# EAGLE design OptoSense (EAGLE 9.3.2)

## Sheet 1 of 3
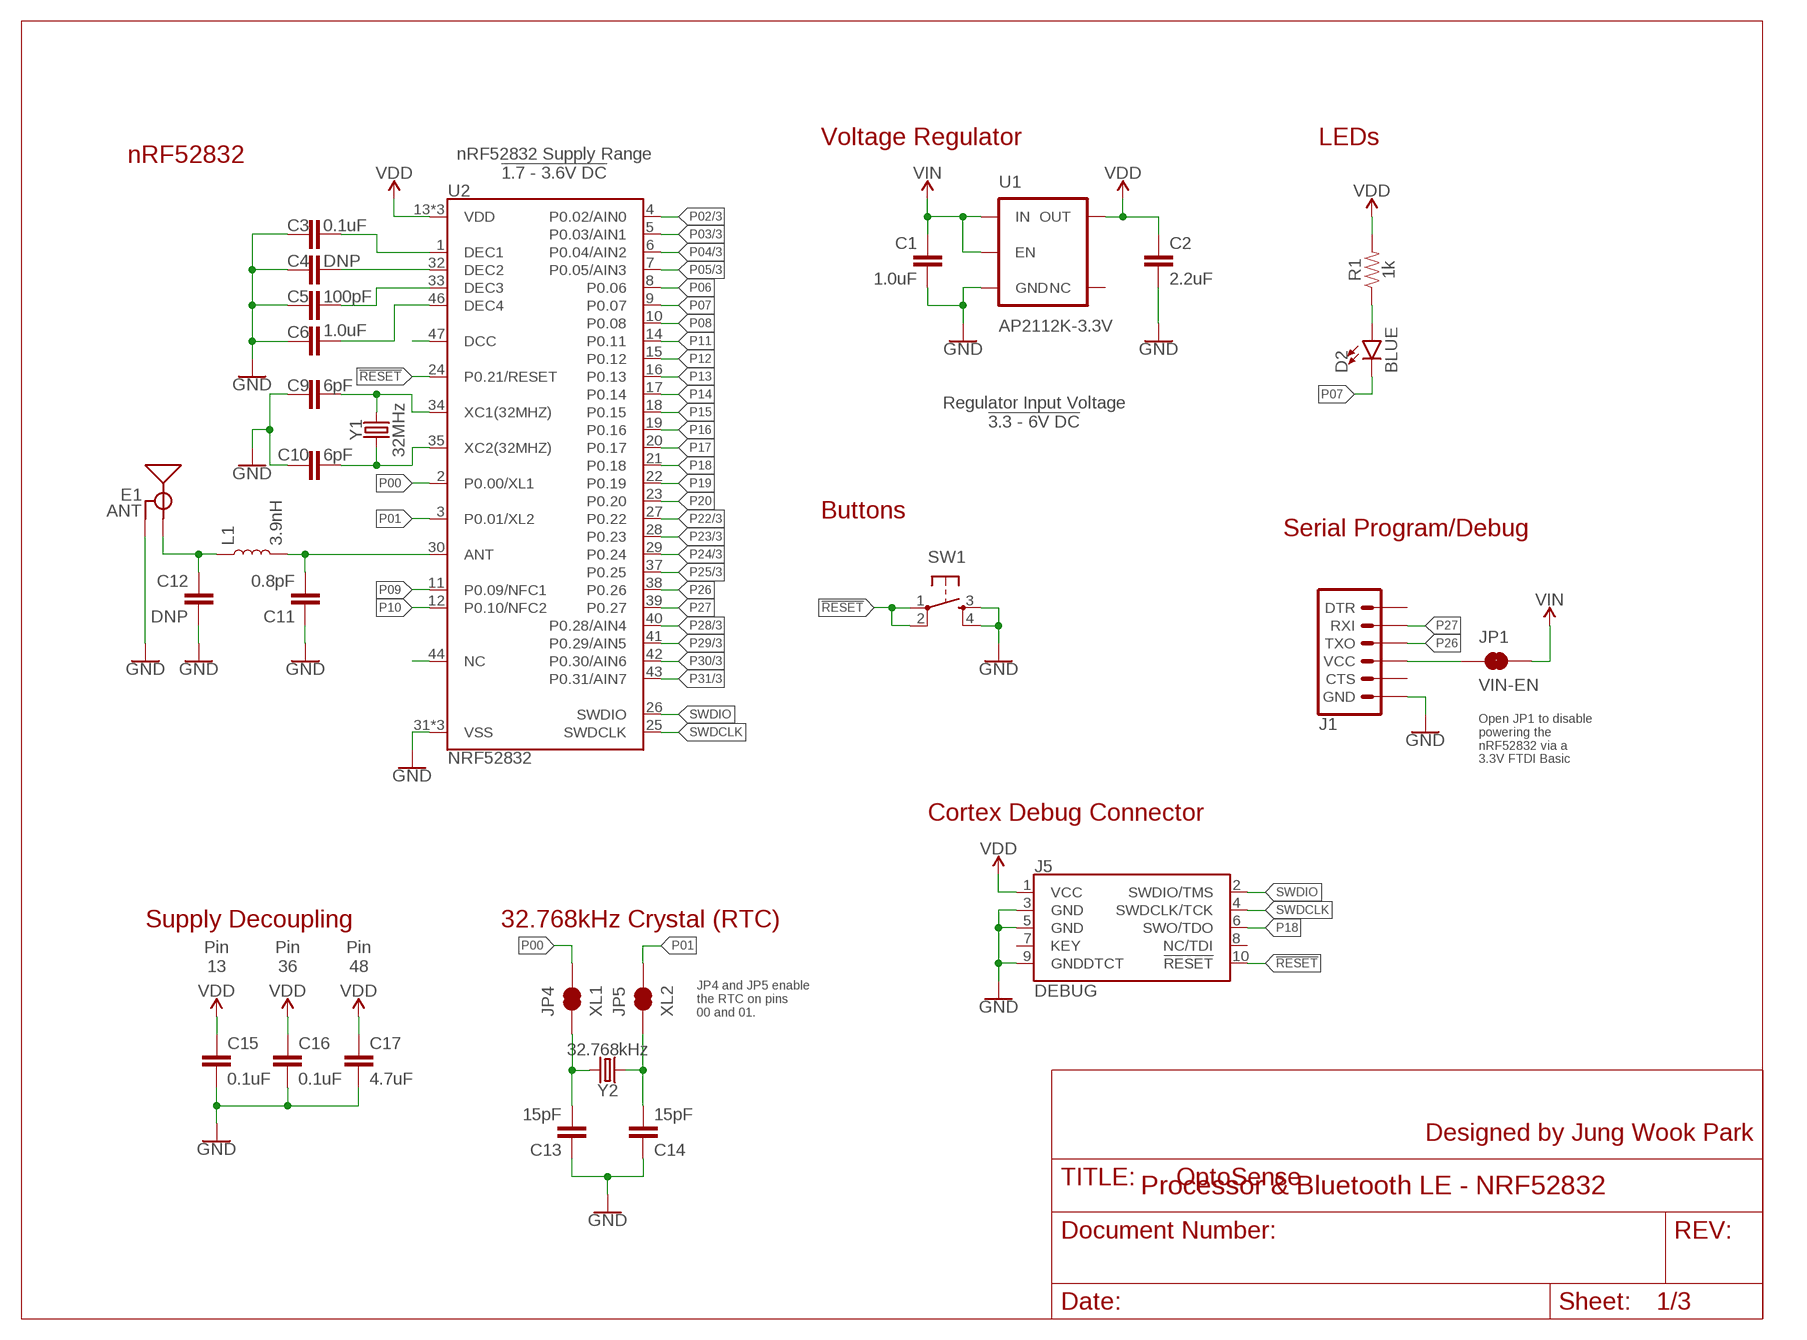
[diagram p0: schematic, sheet 1]

### Parts
C1  1.0uF  1.0UF-0603-16V-10%  [0603]
C2  2.2uF  2.2UF-0603-10V-20%  [0603]
C3  0.1uF  0.1UF-0402-16V-10%  [0402]
C4  DNP  CAP0402  [0402]
C5  100pF  100PF-0402-50V-5%  [0402]
C6  1.0uF  1.0UF-0402-16V-10%  [0402]
C9  6pF  6PF-0402-50V-0.5%  [0402]
C10  6pF  6PF-0402-50V-0.5%  [0402]
C11  0.8pF  0.8PF-0402-50V-0.1PF  [0402]
C12  DNP  CAP0402  [0402]
C13  15pF  15PF-0402-50V-5%  [0402]
C14  15pF  15PF-0402-50V-5%  [0402]
C15  0.1uF  0.1UF-0402-16V-10%  [0402]
C16  0.1uF  0.1UF-0402-16V-10%  [0402]
C17  4.7uF  4.7UF0603  [0603]
D2  BLUE  LED-BLUE0603  [LED-0603]
E1  ANT  ANTENNA-GROUNDEDTRACE-15.2MM  [TRACE_ANTENNA_2.4GHZ_15.2MM]
J1  ARDUINO_SERIAL_PROGRAMPTH  [1X06]
J5  DEBUG  CORTEX_DEBUGPTH  [2X5-PTH-1.27MM]
JP1  VIN-EN  JUMPER-SMT_2_NC_TRACE_SILK  [SMT-JUMPER_2_NC_TRACE_SILK]
JP4  XL1  JUMPER-PAD-2-NC_BY_TRACE  [PAD-JUMPER-2-NC_BY_TRACE_YES_SILK]
JP5  XL2  JUMPER-PAD-2-NC_BY_TRACE  [PAD-JUMPER-2-NC_BY_TRACE_YES_SILK]
L1  3.9nH  INDUCTOR-0402-3.9NH  [0402]
R1  1k  1KOHM-0603-1/10W-1%  [0603]
SW1  SWITCH_SPST_4_PINRECT  [TACTILE_SWITCH_SMD_4.6X2.8MM]
U1  AP2112K-3.3V  V_REG_AP2112K-3.3V  [SOT23-5]
U2  NRF52832  [QFN48-6X6MM]
Y1  32MHz  CRYSTAL-32MHZ-SMD-2.0X1.6MM  [CRYSTAL-SMD-2.0X1.6MM]
Y2  32.768kHz  CRYSTAL-32.768KHZSMD-3.2X1.5  [CRYSTAL-SMD-3.2X1.5MM]

### Nets
!RESET!: J5.10(!RESET) SW1.1 SW1.2 U2.24(P0.21/RESET)
ANT: C11.2 L1.2 U2.30(ANT)
DCC: U2.47(DCC)
DEC1: C3.2 U2.1(DEC1)
DEC2: C4.2 U2.32(DEC2)
DEC3: C5.2 U2.33(DEC3)
DEC4: C6.2 U2.46(DEC4)
GND: C1.2 C2.2 C3.1 C4.1 C5.1 C6.1 C9.1 C10.2 C11.1 C12.2 C13.1 C14.1 C15.2 C16.2 C17.2 E1.GND J1.6(GND) J5.3(GND) J5.5(GND) J5.9(GNDDTCT) SW1.3 SW1.4 U1.2(GND) U2.31(VSS) U2.45(VSS) U2.EP(VSS) ; also sheet 2,3
N$3: C13.2 JP4.1 Y2.P$2
N$4: C14.2 JP5.1 Y2.P$1
N$11: C12.1 E1.ANT(SIGNAL) L1.1
N$14: J1.4(VCC) JP1.1
N$15: D2.A R1.1
NC: U2.44(NC)
P00: JP4.2 U2.2(P0.00/XL1)
P01: JP5.2 U2.3(P0.01/XL2)
P02: U2.4(P0.02/AIN0) ; also sheet 3
P03: U2.5(P0.03/AIN1) ; also sheet 3
P04: U2.6(P0.04/AIN2) ; also sheet 3
P05: U2.7(P0.05/AIN3) ; also sheet 3
P06: U2.8(P0.06)
P07: D2.C U2.9(P0.07)
P08: U2.10(P0.08)
P09: U2.11(P0.09/NFC1)
P10: U2.12(P0.10/NFC2)
P11: U2.14(P0.11)
P12: U2.15(P0.12)
P13: U2.16(P0.13)
P14: U2.17(P0.14)
P15: U2.18(P0.15)
P16: U2.19(P0.16)
P17: U2.20(P0.17)
P18: J5.6(SWO/TDO) U2.21(P0.18)
P19: U2.22(P0.19)
P20: U2.23(P0.20)
P22: U2.27(P0.22) ; also sheet 3
P23: U2.28(P0.23) ; also sheet 3
P24: U2.29(P0.24) ; also sheet 3
P25: U2.37(P0.25) ; also sheet 3
P26: J1.3(TXO) U2.38(P0.26)
P27: J1.2(RXI) U2.39(P0.27)
P28: U2.40(P0.28/AIN4) ; also sheet 3
P29: U2.41(P0.29/AIN5) ; also sheet 3
P30: U2.42(P0.30/AIN6) ; also sheet 3
P31: U2.43(P0.31/AIN7) ; also sheet 3
SWDCLK: J5.4(SWDCLK/TCK) U2.25(SWDCLK)
SWDIO: J5.2(SWDIO/TMS) U2.26(SWDIO)
VDD: C2.1 C15.1 C16.1 C17.1 J5.1(VCC) R1.2 U1.5(OUT) U2.13(VDD) U2.36(VDD) U2.48(VDD) ; also sheet 3
VIN: C1.1 JP1.2 U1.1(IN) U1.3(EN) ; also sheet 2
XC1: C9.2 U2.34(XC1(32MHZ)) Y1.3
XC2: C10.1 U2.35(XC2(32MHZ)) Y1.1
Unconnected: J1.1(DTR) J1.5(CTS) J5.7(KEY) J5.8(NC/TDI) U1.4(NC)

### Notes on the sheet
- Voltage Regulator | LEDs
- nRF52832
- nRF52832 Supply Range
  !1.7 - 3.6V DC!
- Regulator Input Voltage
  !3.3 - 6V DC!
- Buttons
- Serial Program/Debug
- Open JP1 to disable 
  powering the 
  nRF52832 via a
  3.3V FTDI Basic
- Cortex Debug Connector
- Supply Decoupling | 32.768kHz Crystal (RTC)
- Pin
  13
- Pin
  36
- Pin
  48
- JP4 and JP5 enable
  the RTC on pins
  00 and 01.
- Designed by Jung Wook Park
- Processor & Bluetooth LE - NRF52832

## Sheet 2 of 3
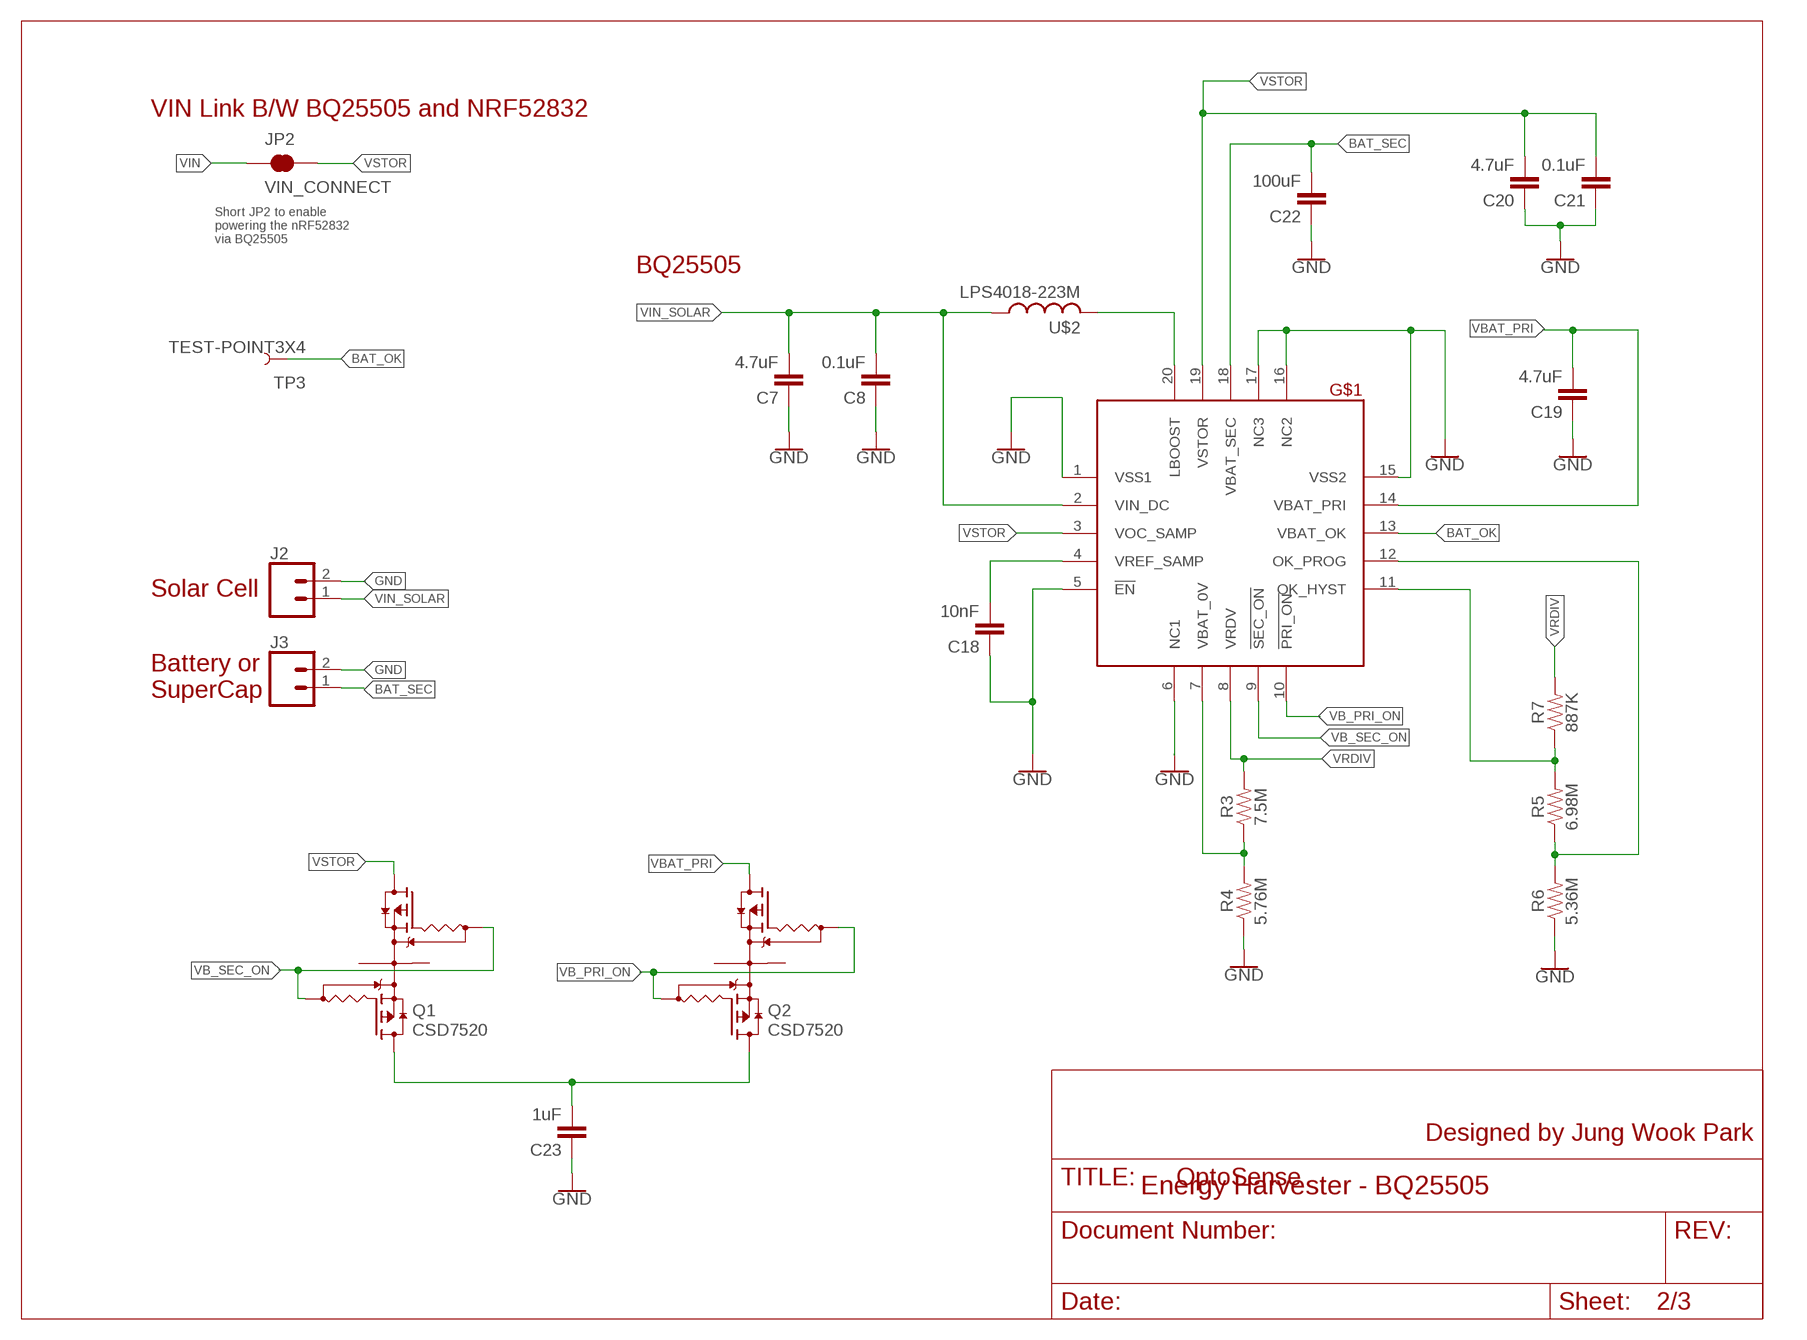
[diagram p1: schematic, sheet 2]

### Parts
C7  4.7uF  0.8PF-0402-50V-0.1PF  [0402]
C8  0.1uF  0.8PF-0402-50V-0.1PF  [0402]
C18  10nF  0.8PF-0402-50V-0.1PF  [0402]
C19  4.7uF  0.8PF-0402-50V-0.1PF  [0402]
C20  4.7uF  0.8PF-0402-50V-0.1PF  [0402]
C21  0.1uF  0.8PF-0402-50V-0.1PF  [0402]
C22  100uF  0.8PF-0402-50V-0.1PF  [0402]
C23  1uF  0.8PF-0402-50V-0.1PF  [0402]
J2  CONN_02  [1X02]
J3  CONN_02  [1X02]
JP2  VIN_CONNECT  JUMPER-SMT_2_NC_TRACE_SILK  [SMT-JUMPER_2_NC_TRACE_SILK]
Q1  CSD7520  CSD75205W1015-BGA  [CSD75205W1015]
Q2  CSD7520  CSD75205W1015-BGA  [CSD75205W1015]
R3  7.5M  1KOHM-0603-1/10W-1%  [0603]
R4  5.76M  1KOHM-0603-1/10W-1%  [0603]
R5  6.98M  1KOHM-0603-1/10W-1%  [0603]
R6  5.36M  1KOHM-0603-1/10W-1%  [0603]
R7  887K  1KOHM-0603-1/10W-1%  [0603]
TP3  TEST-POINT3X4  [PAD.03X.04]
U$1  BQ25505  [QFN20]
U$2  LPS4018-223M  LPS4018  [LPS4018]

### Nets
BAT_OK: TP3.P$1 U$1.13(VBAT_OK)
BAT_SEC: C22.2 J3.1 U$1.18(VBAT_SEC)
GND: C7.1 C8.1 C18.1 C19.1 C20.1 C21.1 C22.1 C23.1 J2.2 J3.2 R4.1 R6.1 U$1.1(VSS1) U$1.5(!EN) U$1.6(NC1) U$1.15(VSS2) U$1.16(NC2) U$1.17(NC3) ; also sheet 1,3
N$2: U$1.20(LBOOST) U$2.P$2
N$5: C18.2 U$1.4(VREF_SAMP)
N$6: R3.1 R4.2 U$1.7(VBAT_0V)
N$7: R5.1 R6.2 U$1.12(OK_PROG)
N$8: R5.2 R7.1 U$1.11(OK_HYST)
N$9: C23.2 Q1.D1 Q2.D1
VB_PRI_ON: Q2.G1 Q2.G2 U$1.10(!PRI_ON)
VB_SEC_ON: Q1.G1 Q1.G2 U$1.9(!SEC_ON)
VBAT_PRI: C19.2 Q2.D2 U$1.14(VBAT_PRI)
VIN: JP2.1 ; also sheet 1
VIN_SOLAR: C7.2 C8.2 J2.1 U$1.2(VIN_DC) U$2.P$1
VRDIV: R3.2 R7.2 U$1.8(VRDV)
VSTOR: C20.2 C21.2 JP2.2 Q1.D2 U$1.3(VOC_SAMP) U$1.19(VSTOR)
Unconnected: Q1.S1 Q1.S2 Q2.S1 Q2.S2

### Notes on the sheet
- VIN Link B/W BQ25505 and NRF52832
- Short JP2 to enable 
  powering the nRF52832 
  via BQ25505
- BQ25505
- Solar Cell
- Battery or
  SuperCap
- Designed by Jung Wook Park
- Energy Harvester - BQ25505

## Sheet 3 of 3
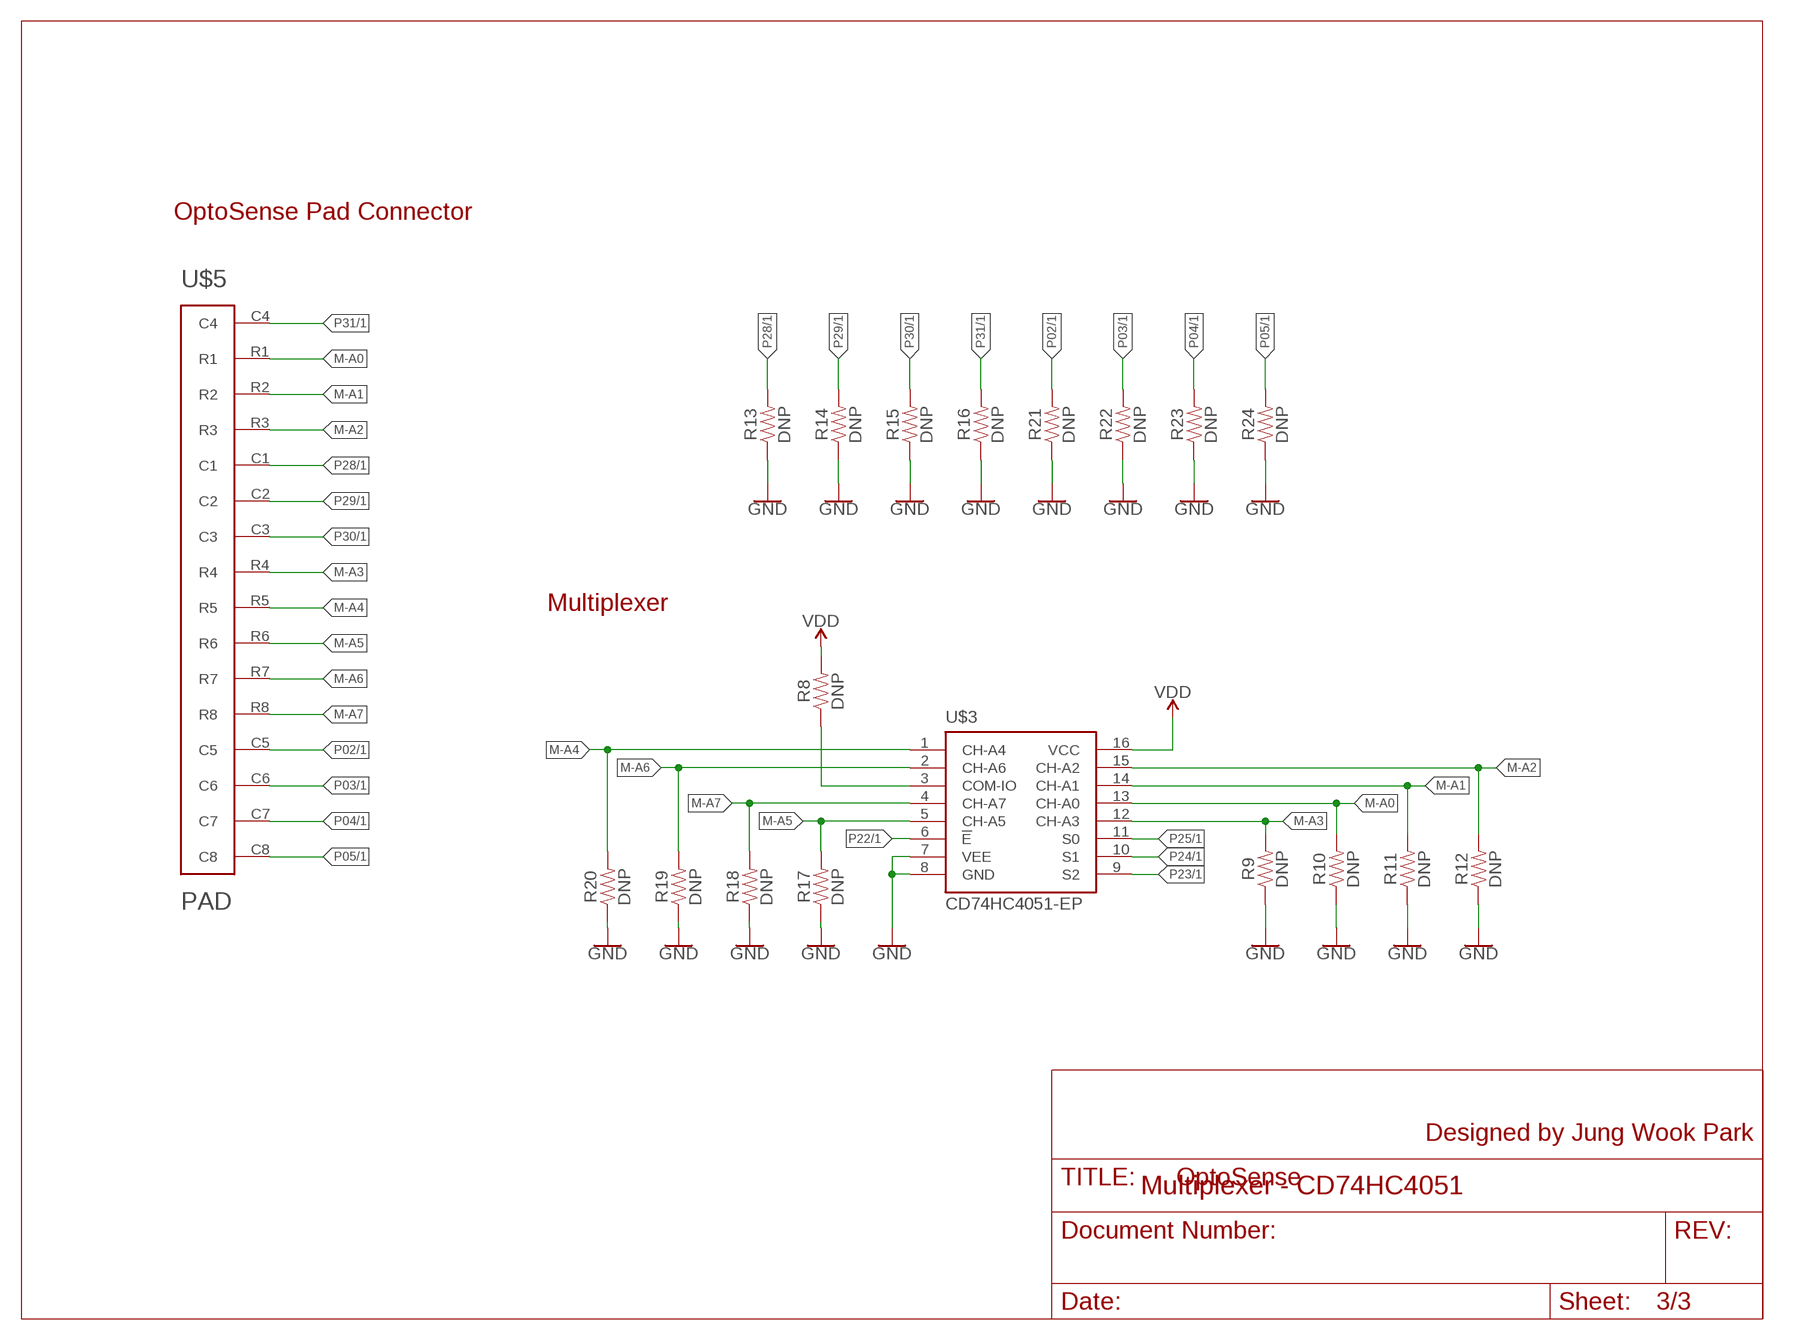
[diagram p2: schematic, sheet 3]

### Parts
R8  DNP  1KOHM-0603-1/10W-1%  [0603]
R9  DNP  1KOHM-0603-1/10W-1%  [0603]
R10  DNP  1KOHM-0603-1/10W-1%  [0603]
R11  DNP  1KOHM-0603-1/10W-1%  [0603]
R12  DNP  1KOHM-0603-1/10W-1%  [0603]
R13  DNP  1KOHM-0603-1/10W-1%  [0603]
R14  DNP  1KOHM-0603-1/10W-1%  [0603]
R15  DNP  1KOHM-0603-1/10W-1%  [0603]
R16  DNP  1KOHM-0603-1/10W-1%  [0603]
R17  DNP  1KOHM-0603-1/10W-1%  [0603]
R18  DNP  1KOHM-0603-1/10W-1%  [0603]
R19  DNP  1KOHM-0603-1/10W-1%  [0603]
R20  DNP  1KOHM-0603-1/10W-1%  [0603]
R21  DNP  1KOHM-0603-1/10W-1%  [0603]
R22  DNP  1KOHM-0603-1/10W-1%  [0603]
R23  DNP  1KOHM-0603-1/10W-1%  [0603]
R24  DNP  1KOHM-0603-1/10W-1%  [0603]
U$3  CD74HC4051-EP  [SO16]
U$5  PAD  OPTOSENSE_PAD_CONNECTOR16  [PADS-16]

### Nets
GND: R9.1 R10.1 R11.1 R12.1 R13.1 R14.1 R15.1 R16.1 R17.1 R18.1 R19.1 R20.1 R21.1 R22.1 R23.1 R24.1 U$3.7(VEE) U$3.8(GND) ; also sheet 1,2
M-A0: R10.2 U$3.13(CH-A0) U$5.R1
M-A1: R11.2 U$3.14(CH-A1) U$5.R2
M-A2: R12.2 U$3.15(CH-A2) U$5.R3
M-A3: R9.2 U$3.12(CH-A3) U$5.R4
M-A4: R20.2 U$3.1(CH-A4) U$5.R5
M-A5: R17.2 U$3.5(CH-A5) U$5.R6
M-A6: R19.2 U$3.2(CH-A6) U$5.R7
M-A7: R18.2 U$3.4(CH-A7) U$5.R8
N$10: R8.1 U$3.3(COM-IO)
P02: R21.2 U$5.C5 ; also sheet 1
P03: R22.2 U$5.C6 ; also sheet 1
P04: R23.2 U$5.C7 ; also sheet 1
P05: R24.2 U$5.C8 ; also sheet 1
P22: U$3.6(!E) ; also sheet 1
P23: U$3.9(S2) ; also sheet 1
P24: U$3.10(S1) ; also sheet 1
P25: U$3.11(S0) ; also sheet 1
P28: R13.2 U$5.C1 ; also sheet 1
P29: R14.2 U$5.C2 ; also sheet 1
P30: R15.2 U$5.C3 ; also sheet 1
P31: R16.2 U$5.C4 ; also sheet 1
VDD: R8.2 U$3.16(VCC) ; also sheet 1

### Notes on the sheet
- OptoSense Pad Connector
- Multiplexer
- Designed by Jung Wook Park
- Multiplexer - CD74HC4051

## Library data of the parts
C1 = SparkFun-Capacitors:1.0UF: 1µF ceramic capacitors A capacitor is a passive two-terminal electrical component used to store electrical energy temporarily in an electric field.; PROD_ID: CAP-00868
C2 = SparkFun-Capacitors:2.2UF: 2.2µF ceramic capacitors A capacitor is a passive two-terminal electrical component used to store electrical energy temporarily in an electric field.; PROD_ID: CAP-07888
C3 C15 C16 = SparkFun-Capacitors:0.1UF: 0.1µF ceramic capacitors A capacitor is a passive two-terminal electrical component used to store electrical energy temporarily in an electric field.; PROD_ID: CAP-12416
C4 C12 = SparkFun-Passives:CAP: Capacitor Standard 0603 ceramic capacitor, and 0.1" leaded capacitor.
C5 = nrf52832-breakout-temp:100PF: 100pF/0.1nF ceramic capacitors A capacitor is a passive two-terminal electrical component used to store electrical energy temporarily in an electric field.; PROD_ID: CAP-13458
C6 = SparkFun-Capacitors:1.0UF: 1µF ceramic capacitors A capacitor is a passive two-terminal electrical component used to store electrical energy temporarily in an electric field.; PROD_ID: CAP-12417
C7 C8 C18-C23 = nrf52832-breakout-temp:0.8PF: 0.8pF ceramic capacitors A capacitor is a passive two-terminal electrical component used to store electrical energy temporarily in an electric field.; PROD_ID: CAP-13456; VALUE: 0.8pF
C9 C10 = nrf52832-breakout-temp:6PF: 15pF ceramic capacitors A capacitor is a passive two-terminal electrical component used to store electrical energy temporarily in an electric field.; PROD_ID: CAP-13455
C11 = nrf52832-breakout-temp:0.8PF: 0.8pF ceramic capacitors A capacitor is a passive two-terminal electrical component used to store electrical energy temporarily in an electric field.; PROD_ID: CAP-13456
C13 C14 = SparkFun-Capacitors:15PF: 15pF ceramic capacitors A capacitor is a passive two-terminal electrical component used to store electrical energy temporarily in an electric field.; PROD_ID: CAP-13063
C17 = SparkFun-Capacitors:4.7UF: 4.7µF ceramic capacitors A capacitor is a passive two-terminal electrical component used to store electrical energy temporarily in an electric field.; PROD_ID: CAP-08280
D2 = SparkFun-LED:LED-BLUE: Blue SMD LED Used in manufacturing of various products at SparkFun Packages: 0603 - SMD 0603 package [Product Link] <http://www.digikey.com/product-detail/en/SMLE12BC7TT86/511-1589-2-ND/1641808> 1206 - SMD1206 package [Product Link] <http://www.digikey.com/product-detail/en/lite-on-inc/LTST-C150TBKT/160-1643-1-ND/573584> SparkFun Products: ESP8266 Thing-Dev Board <https://www.sparkfun.com/products/13711> RedBoard <https://www.sparkfun.com/products/12757>; PROD_ID: DIO-08575
E1 = SparkFun-RF:ANTENNA-GROUNDED: Antenna w/ Ground Connection 2.4GHz antennae with signal and ground terminals. TRACE_ANTENNA_2.4GHZ_15.2MM - Meander Trace antenna 15.2 x 5.7mm footprint Based on layout from TI app note AN043 <http://www.ti.com/lit/an/swra117d/swra117d.pdf>. TRACE_ANTENNA_2.4GHZ_25.7MM - Inverted F trace antenna 25.7 x 7.5 mm footprint. Based on layout from TI design note DN0007 <http://www.ti.com/lit/an/swru120b/swru120b.pdf>.
J1 = SparkFun-Connectors:ARDUINO_SERIAL_PROGRAM: FTDI connector footprints
J2 J3 = SparkFun-Connectors:CONN_02: Multi connection point. Often used as Generic Header-pin footprint for 0.1 inch spaced/style header connections On any of the 0.1 inch spaced packages, you can populate with these: Break Away Headers - Straight <https://www.sparkfun.com/products/116> (PRT-00116) Break Away Male Headers - Right Angle <https://www.sparkfun.com/products/553> (PRT-00553) Female Headers <https://www.sparkfun.com/products/115> (PRT-00115) Break Away Headers - Machine Pin <https://www.sparkfun.com/products/117> (PRT-00117) Break Away Female Headers - Swiss Machine Pin <https://www.sparkfun.com/products/743> (PRT-00743) For SCREWTERMINALS and SPRING TERMINALS visit here: Screw Terimnals on SparkFun.com <https://www.sparkfun.com/search/results?term=Screw+Terminals> (5mm/3.5mm/2.54mm spacing) This device is also useful as a general connection point to wire up your design to another part of your project. Our various solder wires solder well into these plated through hole pads. Hook-Up Wire - Assortment (Stranded, 22 AWG) <https://www.sparkfun.com/products/11375> (PRT-11375) Hook-Up Wire - Assortment (Solid Core, 22 AWG) <https://www.sparkfun.com/products/11367> (PRT-11367) View the entire wire category on our website here <https://www.sparkfun.com/categories/141> Special notes: Molex polarized connector foot print use with: PRT-08233 with associated crimp pins and housings. 2.54_SCREWTERM for use with PRT-10571. 3.5mm Screw Terminal footprints for PRT-08084 5mm Screw Terminal footprints for use with PRT-08432
J5 = SparkFun-Connectors:CORTEX_DEBUG: Cortex Debug Connector Datasheet <http://infocenter.arm.com/help/topic/com.arm.doc.faqs/attached/13634/cortex_debug_connectors.pdf>
JP1 JP2 = SparkFun-Jumpers:JUMPER-SMT_2_NC_TRACE: Normally closed trace jumper This jumper has a trace between two pads so it's normally closed (NC). Use a razor knife to open the connection. For best results follow the IPC guidelines for cutting traces: Cutout at least 0.063 mm (0.005 in). Remove all loose material to clean up the cut area. Seal the cut with an approved epoxy. Reapply solder to reclose the connection.
JP4 JP5 = SparkFun-Jumpers:JUMPER-PAD-2-NC_BY_TRACE
L1 = nrf52832-breakout-temp:INDUCTOR: Inductors Resist changes in electrical current. Basically a coil of wire. SparkFun Products: SparkFun Load Cell Amplifier - HX711 <https://www.sparkfun.com/products/13879> IOIO-OTG - V2.2 <https://www.sparkfun.com/products/13613>; PROD_ID: NDUC-13457
Q1 Q2 = bqevm_additional_ti_ics:CSD75205W1015: According to: http://www.ti.com/lit/ds/symlink/csd75205w1015.pdf
R1 = SparkFun-Resistors:1KOHM: 1kΩ resistor A resistor is a passive two-terminal electrical component that implements electrical resistance as a circuit element. Resistors act to reduce current flow, and, at the same time, act to lower voltage levels within circuits.; PROD_ID: RES-07856
R3-R24 = SparkFun-Resistors:1KOHM: 1kΩ resistor A resistor is a passive two-terminal electrical component that implements electrical resistance as a circuit element. Resistors act to reduce current flow, and, at the same time, act to lower voltage levels within circuits.; PROD_ID: RES-07856; VALUE: 1k
SW1 = SparkFun-Electromechanical:SWITCH_SPST_4_PIN; PROD_ID: SWCH-13065
TP3 = SparkFun-Connectors:TEST-POINT: Bare copper test points for troubleshooting or ICT
U1 = SparkFun-PowerIC:V_REG_AP2112: AP2112 - 600mA CMOS LDO Regulator w/ Enable The AP2112 is CMOS process low dropout linear regulator with enable function, the regulator delivers a guaranteed 600mA (min.) continuous load current. Features Output Voltage Accuracy: ±1.5% Output Current: 600mA (Min.) Foldback Short Current Protection: 50mA Enable Function to Turn ON/OFF VOUT Low Dropout Voltage (3.3V): 250mV (Typ.) @IOUT=600mA Excellent Load Regulation: 0.2%/A (Typ.) Excellent Line Regulation: 0.02%/V (Typ.) Low Quiescent Current: 55μA (Typ.) Low Standby Current: 0.01μA (Typ.) Low Output Noise: 50μVRMS PSRR: 100Hz -65dB, 1kHz -65dB OTSD Protection Stable with 1.0μF Flexible Cap: Ceramic, Tantalum and Aluminum Electrolytic Operation Temperature Range: -40°C to 85°C ESD: MM 400V, HBM 4000V; PROD_ID: VREG-12457; VALUE: 3.3V
U2 = nrf52832-breakout-temp:NRF52832: Nordic nRF52832 Bluetooth Smart/ANT/2.4GHz RF SoC The nRF52832 SoC is a powerful, highly flexible ultra-low power multiprotocol SoC ideally suited for Bluetooth® Smart ANT and 2.4GHz ultra low-power wireless applications. The nRF52832 SoC is built around a 32-bit ARM® Cortex™-M4F CPU with 512kB + 64kB RAM. The embedded 2.4GHz transceiver supports Bluetooth Smart, ANT and proprietary 2.4 GHz protocol stack. It is on air compatible with the nRF51 Series, nRF24L and nRF24AP Series products from Nordic Semiconductor. Product Page <https://www.nordicsemi.com/eng/Products/Bluetooth-low-energy2/nRF52832>; PROD_ID: IC-13460
U$1 = BQ25505:BQ25505
U$2 = coilcraft:LPS4018
U$3 = OptoSense:CD74HC4051-EP
U$5 = OptoSense:OPTOSENSE_PAD_CONNECTOR16
Y1 = nrf52832-breakout-temp:CRYSTAL-32MHZ: 32MHz Crystal Digikey Example <http://www.digikey.com/product-detail/en/murata-electronics-north-america/XRCGB32M000F2P00R0/490-9769-1-ND/4952013> Frequency: 32MHz Frequency Stability: ±20ppm Frequency Tolerance: ±20ppm Load Capacitance: 6pF; PROD_ID: XTAL-13459
Y2 = SparkFun-Clocks:CRYSTAL-32.768KHZ: 32.768kHz Crystal Frequency: 32.768kHz Frequency Stability: ±20ppm Load Capacitance: 12.5pF (PTH-2X6 & SMD-3.2X1.5), 6pF (SMD-2X6); PROD_ID: XTAL-13062

## Board
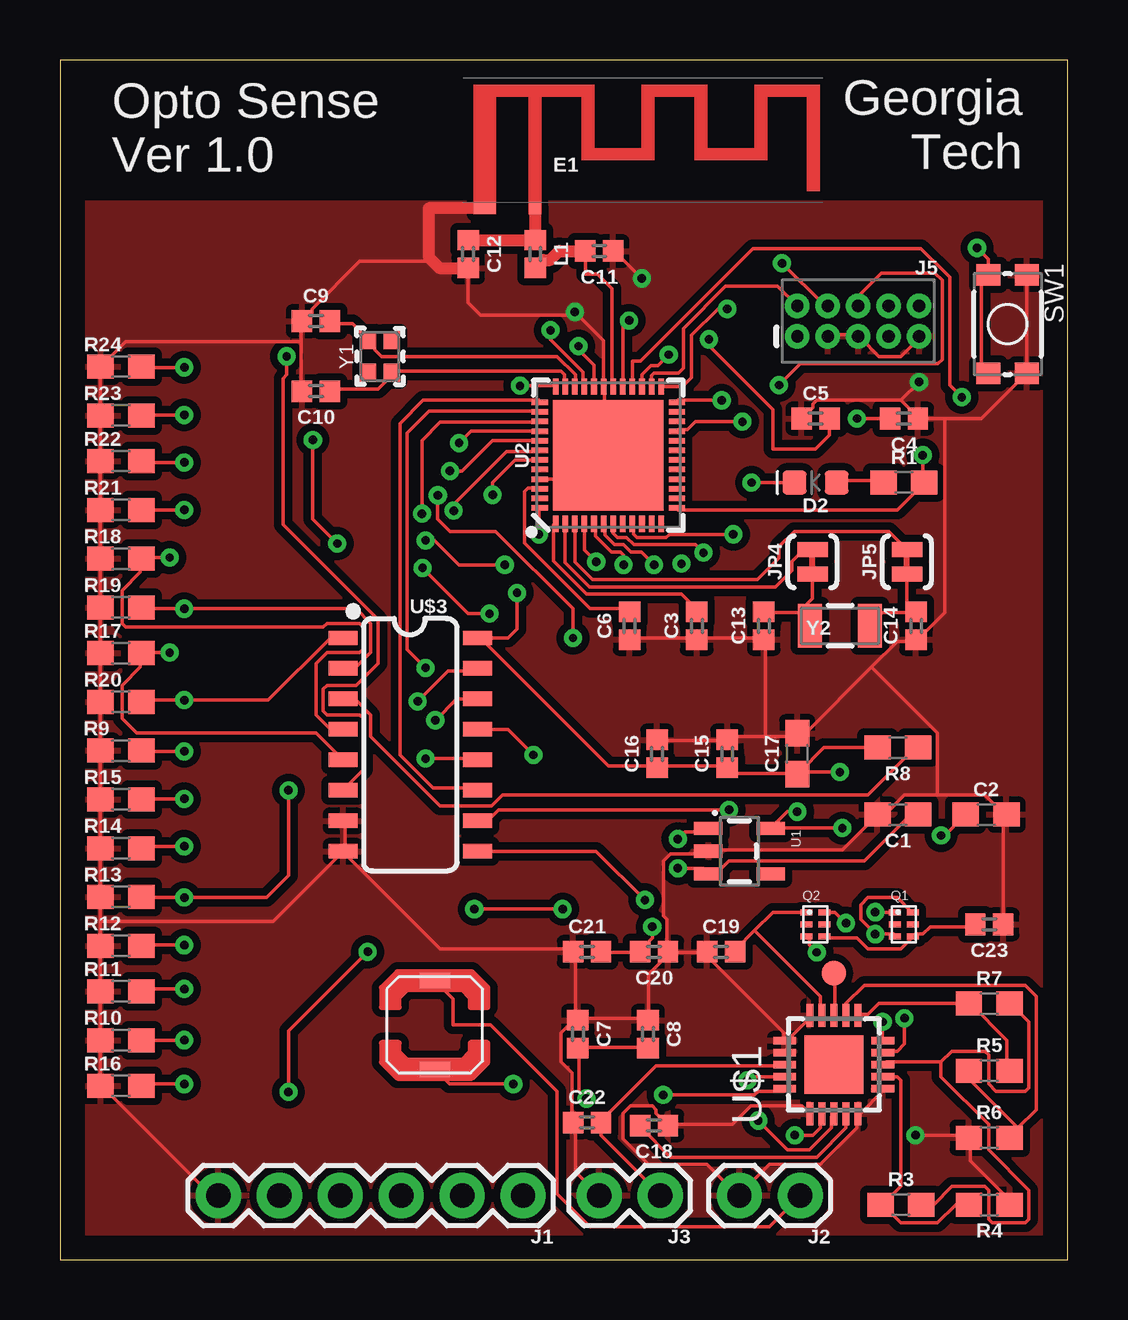
[diagram p3: board, top side]
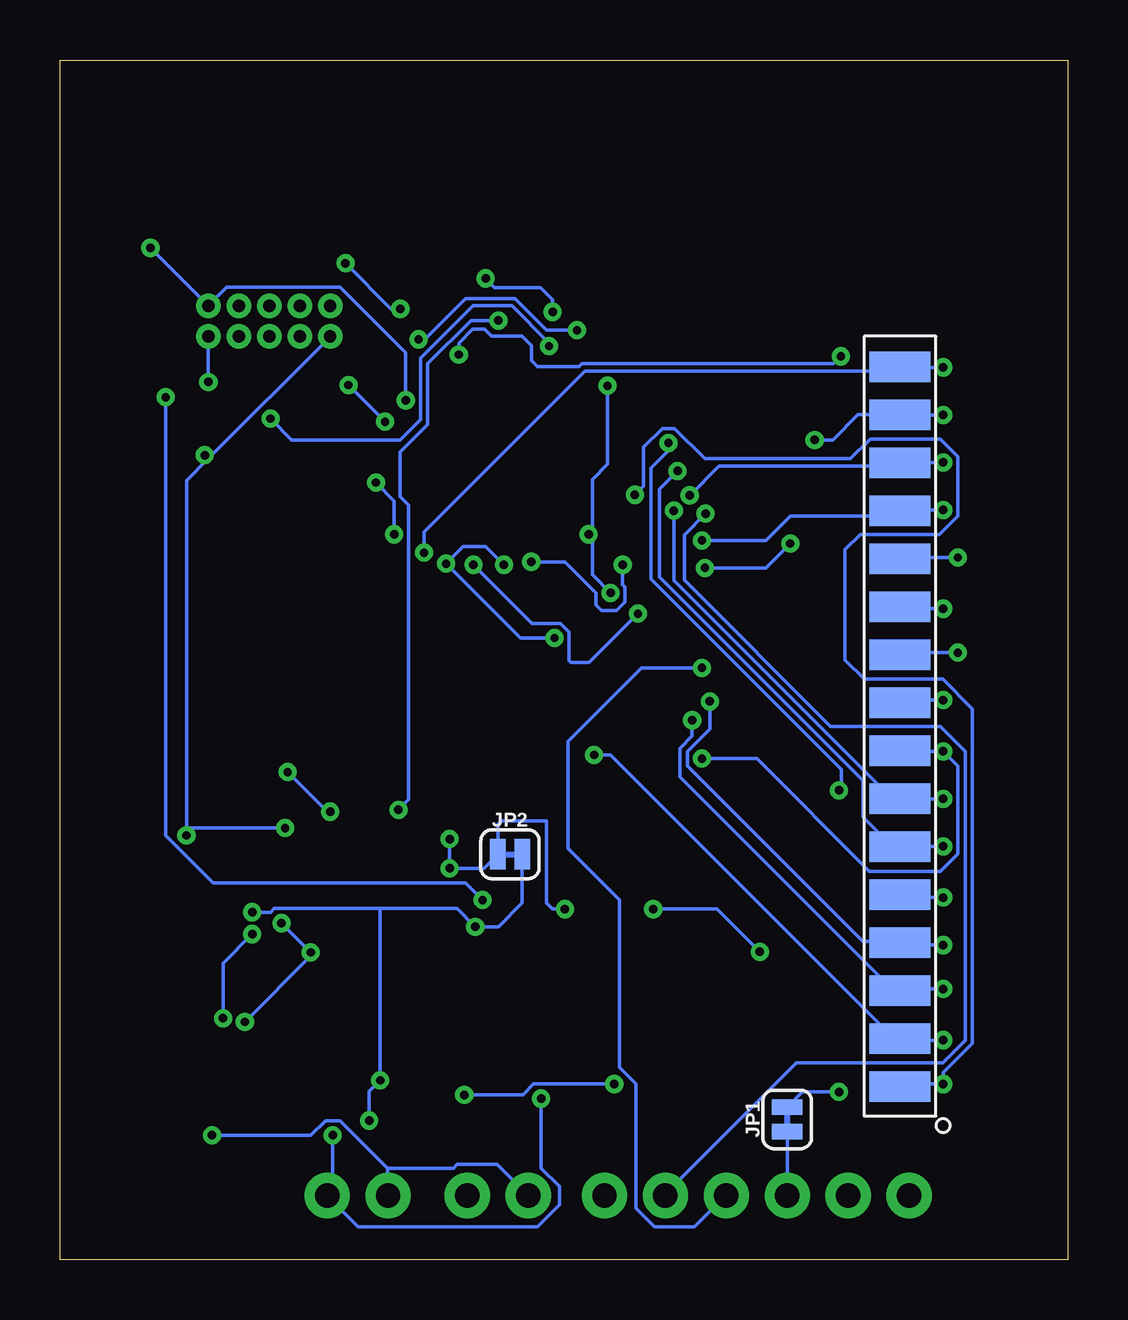
[diagram p4: board, bottom side, seen from below]

Size 42 x 50 mm. Coordinates in mm from the lower left corner, seen from the top.
Outline: 0,0 42,0 42,50 0,50 0,0
Copper layers (1*16): Top 0.035mm / dielectric 1.5mm / Bottom 0.035mm
Design rules "default": minimum track width 6mil, minimum drill 0.35mm, track to track 6mil, track to pad 6mil, pad to pad 6mil, via to via 6mil, smd to smd 6mil, copper to edge 40mil, drill to drill 6mil, minimum pad ring 10mil, minimum via ring 8mil, stop-mask expansion 4mil, vias tented up to drill 0mil, thermal gap 10mil

### Footprints (pad centres in the part's own frame; a part is rotated, then mirrored left to right if it is on the bottom)
0603 = smd 1.1 x 1: 1 -0.85,0; 2 0.85,0
0402 = smd 0.85 x 0.9: 1 -0.58,0; 2 0.58,0
LED-0603 = smd 1 x 1: A -0.877,0; C 0.877,0
TRACE_ANTENNA_2.4GHZ_15.2MM = smd 0.5 x 0.5: ANT 0,-0.25 | smd 0.9 x 0.5: GND -2.1,-0.25
1X06 = drill 1.016 pad 1.88: 1 0,0; 2 2.54,0; 3 5.08,0; 4 7.62,0; 5 10.16,0; 6 12.7,0
1X02 = drill 1.016 pad 1.88: 1 0,0; 2 2.54,0
2X5-PTH-1.27MM = drill 0.508 pad 1: 1 -2.54,-0.635; 2 -2.54,0.635; 3 -1.27,-0.635; 4 -1.27,0.635; 5 0,-0.635; 6 0,0.635; 7 1.27,-0.635; 8 1.27,0.635; 9 2.54,-0.635; 10 2.54,0.635
SMT-JUMPER_2_NC_TRACE_SILK = smd 0.635 x 1.27: 1 -0.508,0; 2 0.508,0
PAD-JUMPER-2-NC_BY_TRACE_YES_SILK = smd 0.635 x 1.27: 1 -0.508,0; 2 0.508,0
CSD75205W1015 = smd 0.5 x 0.25: D1 0.375,-0.5; D2 -0.375,0.5; G1 -0.375,-0.5; G2 0.375,0.5; S1 0.375,0; S2 -0.375,0
TACTILE_SWITCH_SMD_4.6X2.8MM = smd 0.9 x 1: 1 -2.05,-0.8; 2 2.05,-0.8; 3 2.05,0.8; 4 -2.05,0.8
PAD.03X.04 = smd 1.016 x 1.016: P$1 0,0
SOT23-5 = smd 0.55 x 1.2: 1 -0.95,-1.3; 2 0,-1.3; 3 0.95,-1.3; 4 0.95,1.3; 5 -0.95,1.3
QFN48-6X6MM = smd 0.68 x 0.23: 1 -2.86,2.2; 2 -2.86,1.8; 3 -2.86,1.4; 4 -2.86,1; 5 -2.86,0.6; 6 -2.86,0.2; 7 -2.86,-0.2; 8 -2.86,-0.6; 9 -2.86,-1; 10 -2.86,-1.4; 11 -2.86,-1.8; 12 -2.86,-2.2; 25 2.86,-2.2; 26 2.86,-1.8; 27 2.86,-1.4; 28 2.86,-1; 29 2.86,-0.6; 30 2.86,-0.2; 31 2.86,0.2; 32 2.86,0.6; 33 2.86,1; 34 2.86,1.4; 35 2.86,1.8; 36 2.86,2.2 | smd 0.23 x 0.68: 13 -2.2,-2.86; 14 -1.8,-2.86; 15 -1.4,-2.86; 16 -1,-2.86; 17 -0.6,-2.86; 18 -0.2,-2.86; 19 0.2,-2.86; 20 0.6,-2.86; 21 1,-2.86; 22 1.4,-2.86; 23 1.8,-2.86; 24 2.2,-2.86; 37 2.2,2.86; 38 1.8,2.86; 39 1.4,2.86; 40 1,2.86; 41 0.6,2.86; 42 0.2,2.86; 43 -0.2,2.86; 44 -0.6,2.86; 45 -1,2.86; 46 -1.4,2.86; 47 -1.8,2.86; 48 -2.2,2.86 | smd 4.6 x 4.6: EP 0,0
QFN20 = smd 0.95 x 0.3: 1 -2.05,1; 2 -2.05,0.5; 3 -2.05,0; 4 -2.05,-0.5; 5 -2.05,-1; 11 2.05,-1; 12 2.05,-0.5; 13 2.05,0; 14 2.05,0.5; 15 2.05,1 | smd 0.3 x 0.95: 6 -1,-2.05; 7 -0.5,-2.05; 8 0,-2.05; 9 0.5,-2.05; 10 1,-2.05; 16 1,2.05; 17 0.5,2.05; 18 0,2.05; 19 -0.5,2.05; 20 -1,2.05 | smd 2.45 x 2.45: EXP 0,0
LPS4018 = smd 0.635 x 1.27: P$1 -1.85,0; P$2 1.85,0
SO16 = smd 0.6 x 1.2: 1 -4.445,-2.8; 2 -3.175,-2.8; 3 -1.905,-2.8; 4 -0.635,-2.8; 5 0.635,-2.8; 6 1.905,-2.8; 7 3.175,-2.8; 8 4.445,-2.8; 9 4.445,2.8; 10 3.175,2.8; 11 1.905,2.8; 12 0.635,2.8; 13 -0.635,2.8; 14 -1.905,2.8; 15 -3.175,2.8; 16 -4.445,2.8
PADS-16 = smd 2.54 x 1.27: C1 0,23.27; C2 0,21.27; C3 0,19.27; C4 0,31.27; C5 0,7.27; C6 0,5.27; C7 0,3.27; C8 0,1.27; R1 0,29.27; R2 0,27.27; R3 0,25.27; R4 0,17.27; R5 0,15.27; R6 0,13.27; R7 0,11.27; R8 0,9.27
CRYSTAL-SMD-2.0X1.6MM = smd 0.75 x 0.7: 1 -0.675,-0.5; 2 0.675,-0.5; 3 0.675,0.5; 4 -0.675,0.5
CRYSTAL-SMD-3.2X1.5MM = smd 1 x 1.8: P$1 -1.25,0; P$2 1.25,0

### Placement (x,y rotation side)
C1  34.92,18.54 180 top
C2  38.61,18.54 0 top
C3  26.54,26.42 90 top
C4  35.18,35.05 180 top
C5  31.5,35.05 0 top
C6  23.75,26.42 90 top
C7  21.59,9.4 270 top
C8  24.51,9.4 270 top
C9  10.67,39.12 0 top
C10  10.67,36.2 180 top
C11  22.48,42.04 180 top
C12  17.02,41.91 270 top
C13  29.34,26.42 90 top
C14  35.69,26.42 90 top
C15  27.81,21.08 90 top
C16  24.89,21.08 90 top
C17  30.73,21.08 90 top
C18  24.77,5.59 180 top
C19  27.56,12.83 0 top
C20  24.77,12.83 180 top
C21  21.97,12.83 0 top
C22  21.97,5.71 0 top
C23  38.73,13.97 180 top
D2  31.5,32.38 180 top
E1  19.81,44.07 0 top
J1  19.3,2.67 180 top
J2  30.86,2.67 180 top
J3  25.02,2.67 180 top
J5  33.27,39.12 0 top
JP1  11.68,5.84 90 bottom
JP2  23.24,16.89 0 bottom
JP4  31.37,29.08 90 top
JP5  35.31,29.08 90 top
L1  19.81,41.91 270 top
Q1  35.18,13.97 0 top
Q2  31.5,13.97 0 top
R1  35.18,32.38 0 top
R3  35.05,2.29 0 top
R4  38.73,2.29 180 top
R5  38.73,7.87 0 top
R6  38.73,5.08 0 top
R7  38.73,10.67 0 top
R8  34.92,21.34 180 top
R9  2.54,21.21 0 top
R10  2.54,9.14 0 top
R11  2.54,11.18 0 top
R12  2.54,13.08 0 top
R13  2.54,15.11 0 top
R14  2.54,17.14 0 top
R15  2.54,19.18 0 top
R16  2.54,7.24 0 top
R17  2.54,25.27 0 top
R18  2.54,29.21 0 top
R19  2.54,27.18 0 top
R20  2.54,23.24 0 top
R21  2.54,31.24 0 top
R22  2.54,33.27 0 top
R23  2.54,35.18 0 top
R24  2.54,37.21 0 top
SW1  39.5,38.99 270 top
TP3  32.26,11.94 0 top
U1  28.32,17.02 270 top
U2  22.86,33.53 90 top
U$1  32.26,8.13 90 top
U$2  15.62,9.78 270 top
U$3  14.61,21.46 270 top
U$5  6.99,38.48 180 bottom
Y1  13.34,37.64 90 top
Y2  32.51,26.42 180 top

### Tracks (layer width: path | path; a pad name or v marks a point on that pad's centre or on a via)
!RESET!  (via drill 0.35)
  Top 0.152: SW1.2 38.41,37.25 38.41,40.9 SW1.1 38.7,41.69 v38.23,42.16 | v27.58,35.81 25.76,35.81 U2.24
  Bottom 0.152: v27.58,35.81 27.58,37.8 30.33,40.54 35.05,40.54 35.81,39.78 J5.10 v38.23,42.16
ANT
  Top 0.152: U2.30 23.01,36.42 23.01,40.46 22.4,41.07 21.9,41.07 C11.2
  Top 0.508: L1.2 20.14,41.66 20.43,41.66 20.81,42.04 C11.2
BAT_OK
  Top 0.152: U$1.13 32.31,10.21 32.31,11.89 TP3.P$1
BAT_SEC
  Top 0.152: J3.1 24.99,2.74 22.55,5.18 22.55,5.64 C22.2 22.55,5.79 24.84,8.08 30.18,8.08 U$1.18
DEC1
  Top 0.152: U2.1 20.57,30.63 20.57,29.11 21.95,27.74 25.91,27.74 26.52,27.13 C3.2
DEC2  (via drill 0.35)
  Top 0.152: C4.2 v33.22,35.05 | U2.32 22.26,37.27 21.61,37.92 v21.61,38.08
  Bottom 0.152: v33.22,35.05 32.33,34.16 27.81,34.16 26.98,35 26.98,37.57 24.79,39.75 23.16,39.75 21.61,38.2 v21.61,38.08
DEC3  (via drill 0.35)
  Top 0.152: U2.33 21.8,36.44 21.8,37 20.45,38.35 v20.45,38.73 | v27.05,38.35 27.05,38.1 29.72,35.43 29.72,33.78 31.5,33.78 32.08,34.36 C5.2
  Bottom 0.152: v20.45,38.73 21.72,38.73 23.04,40.06 25.09,40.06 26.8,38.35 v27.05,38.35
DEC4
  Top 0.152: U2.46 19.96,32.16 19.51,32.16 19.36,32 19.36,29.87 22.1,27.13 23.62,27.13 C6.2
GND  (via drill 0.35)
  Top 0.152: U$1.1 31.24,6.1 30.94,6.4 28.8,6.4 28.04,5.64 25.45,5.64 C18.1 25.3,5.64 24.84,6.1 24.84,6.25 24.69,6.4 23.77,6.4 23.47,6.1 23.47,5.03 24.54,3.96 26.98,3.96 28.19,2.74 J2.2 28.35,2.74 29.57,3.96 31.7,3.96 33.22,5.49 33.22,5.94 U$1.5 33.38,6.1 34.29,7.01 U$1.6 | R4.1 39.47,2.29 39.47,2.59 37.95,4.12 37.95,5.03 R6.1 37.8,5.18 v35.66,5.18 | J3.2 21.49,3.66 21.49,5.64 C22.1 21.34,5.79 21.34,7.77 20.88,8.23 20.88,9.45 21.49,10.06 | 21.49,10.06 21.49,12.8 C21.1 21.34,12.95 15.85,12.95 11.89,16.92 U$3.8 | U$1.17 30.33,8.69 30.33,8.99 U$1.16 | U$1.15 31.24,10.06 30.33,9.14 U$1.16 | 26.82,12.8 26.98,12.8 C19.1 26.82,12.8 | 26.82,12.8 25.45,12.8 | 26.82,12.8 30.18,9.45 30.18,9.14 U$1.16 | 25.45,12.8 24.54,11.89 24.54,10.06 C8.1 24.38,10.06 21.64,10.06 C7.1 21.49,10.06 | 25.45,12.8 C20.1 25.3,12.95 25.3,14.17 25.15,14.33 25.15,16.61 25.45,16.92 26.98,16.92 U1.2 27.13,17.07 32.61,17.07 33.98,18.44 C1.2 34.14,18.59 34.44,18.59 35.2,19.36 36.58,19.36 | J5.3 32,38.56 33.22,38.56 J5.5 33.38,38.41 34.14,37.64 35.05,37.64 35.81,38.41 J5.9 | 35.05,35.81 31.55,35.81 31.39,35.66 31.39,35.51 30.94,35.05 C5.1 | 35.81,35.05 35.05,35.81 | 35.81,35.05 36.88,35.05 | 35.81,35.05 C4.1 | 35.05,35.81 v35.81,36.58 | C23.1 39.32,14.02 39.32,18.44 C2.2 39.32,18.59 38.56,19.36 36.58,19.36 | C6.1 23.77,25.91 26.52,25.91 C3.1 26.67,25.91 29.26,25.91 C13.1 29.41,25.76 29.41,21.79 | C16.2 24.99,21.64 27.74,21.64 C15.2 27.89,21.79 29.41,21.79 | 33.83,24.69 31.09,21.95 30.79,21.95 C17.2 30.63,21.79 29.41,21.79 | 33.83,24.69 34.9,25.76 35.66,25.76 C14.1 35.81,25.91 36.88,26.98 36.88,35.05
  Top 0.152: 36.58,19.36 36.58,21.95 33.83,24.69 | 10.06,38.25 10.06,39.01 C9.1 10.21,39.17 10.52,39.47 10.52,39.62 12.5,41.6 15.24,41.6 15.39,41.76 | 10.06,38.25 10.06,36.27 C10.2 | 1.68,31.24 1.68,33.22 R22.1 1.68,33.38 1.68,35.05 R23.1 1.68,35.2 1.68,37.19 R24.1 1.83,37.34 2.74,38.25 10.06,38.25 | 1.68,31.24 1.68,29.26 R18.1 1.68,29.11 1.68,27.28 R19.1 1.68,27.13 1.68,25.3 R17.1 1.68,25.15 1.68,23.32 R20.1 1.68,23.16 1.68,21.34 R9.1 1.68,21.18 1.68,19.2 R15.1 1.68,19.05 1.68,17.22 R14.1 1.68,17.07 1.68,15.24 R13.1 1.68,15.09 1.68,14.1 | 1.68,31.24 R21.1 | 1.68,9.14 1.68,7.32 R16.1 1.83,7.16 6.25,2.74 6.55,2.74 J1.6 | 1.68,9.14 1.68,11.12 R11.1 1.68,11.28 1.68,12.95 R12.1 1.68,13.11 1.68,14.1 | 1.68,9.14 R10.1 | U$3.8 11.89,17.07 11.89,18.29 U$3.7 | C12.2 17.02,39.88 17.53,39.37 21.34,39.37 v21.46,39.5 22.66,38.3 U2.31 22.71,36.27 22.71,33.68 U2.EP 21.86,32.53 U2.45 | SW1.4 SW1.3 38.41,35.05 36.88,35.05 | U$3.8 8.88,14.1 1.68,14.1 | C11.1 23.11,42.04 v24.26,40.89
  Top 0.508: E1.GND 15.37,43.81 15.37,41.78 15.39,41.76 15.82,41.33 C12.2
  Bottom 0.152: v35.66,5.18 31.55,5.18 30.94,5.79 30.33,5.79 28.35,3.81 | 28.35,3.81 28.35,2.74 J2.2 | 28.35,3.81 25.6,3.81 25.45,3.96 23.77,3.96 J3.2 | v35.81,36.58 J5.9 | v24.26,40.89 23.88,40.51 21.97,40.51 21.46,40.01 v21.46,39.5
  pour Top (isolate 0.305): 20.7,44.07 0.13,44.07 0.13,0.13 41.91,0.13 41.91,44.07
M-A0  (via drill 0.35)
  Top 0.152: v5.18,9.14 R10.2 | v19.74,21.03 18.67,22.1 U$3.13
  Bottom 0.152: v5.18,9.14 6.86,9.14 U$5.R1 7.01,9.3 7.32,9.3 19.05,21.03 v19.74,21.03
M-A1  (via drill 0.35)
  Top 0.152: v5.18,11.28 3.5,11.28 R11.2 | U$3.14 16.54,23.37 v15.65,22.48
  Bottom 0.152: v5.18,11.28 6.86,11.28 U$5.R2 7.01,11.28 7.32,11.28 16.15,20.12 16.15,21.31 15.65,21.82 v15.65,22.48
M-A2  (via drill 0.35)
  Top 0.152: v5.18,13.11 3.5,13.11 R12.2 | v14.91,23.27 16.18,24.54 17.37,24.54 U$3.15
  Bottom 0.152: v5.18,13.11 6.86,13.11 U$5.R3 7.01,13.26 8.53,13.26 15.85,20.57 15.85,21.18 14.91,22.12 v14.91,23.27
M-A3  (via drill 0.35)
  Top 0.152: v5.18,21.18 3.5,21.18 R9.2 | v15.24,20.88 17.37,20.88 U$3.12
  Bottom 0.152: U$5.R4 6.86,21.18 v5.18,21.18 4.57,20.57 4.57,16.92 5.31,16.18 8.26,16.18 12.95,20.88 v15.24,20.88
M-A4  (via drill 0.35)
  Top 0.152: U$3.1 11.28,25.91 8.69,23.32 v5.18,23.32 3.5,23.32 R20.2
  Bottom 0.152: v5.18,23.32 6.86,23.32 U$5.R5
M-A5  (via drill 0.35)
  Top 0.152: U$3.5 11.73,20.88 10.67,21.95 3.2,21.95 2.59,22.55 2.59,23.93 3.35,24.69 3.35,25.15 R17.2 3.5,25.3 v4.57,25.3
  Bottom 0.152: v4.57,25.3 6.86,25.3 U$5.R6
M-A6  (via drill 0.35)
  Top 0.152: R19.2 3.5,27.13 v5.18,27.13 12.34,27.13 12.95,26.52 12.95,25.3 12.34,24.69 11.89,24.69 U$3.2
  Bottom 0.152: v5.18,27.13 6.86,27.13 U$5.R7
M-A7  (via drill 0.35)
  Top 0.152: U$3.4 11.28,22.1 10.67,22.71 10.67,24.84 11.12,25.3 12.5,25.3 12.65,25.45 12.65,26.36 12.5,26.52 11.12,26.52 10.97,26.36 2.74,26.36 2.59,26.52 2.59,27.89 3.35,28.65 3.35,29.11 R18.2 3.5,29.26 v4.57,29.26
  Bottom 0.152: v4.57,29.26 6.86,29.26 U$5.R8
N$2  (via drill 0.35)
  Top 0.152: v25.15,6.86 28.96,6.86 29.11,7.01 30.18,7.01 U$1.20 | v18.9,7.32 16.23,7.32 U$2.P$2
  Bottom 0.152: v25.15,6.86 22.71,6.86 22.25,7.32 v18.9,7.32
N$3
  Top 0.152: 30.79,26.98 29.41,26.98 C13.2 | 30.79,26.98 31.24,26.52 Y2.P$2 | 30.79,26.98 31.37,27.56 JP4.1
N$4
  Top 0.152: 35.66,26.98 34.29,26.98 33.83,26.52 Y2.P$1 | 35.66,26.98 C14.2 | JP5.1 35.31,27.33 35.66,26.98
N$5
  Top 0.152: C18.2 24.23,5.49 25.45,4.27 31.55,4.27 32.77,5.49 32.77,5.94 U$1.4
N$6
  Top 0.152: 34.29,2.29 35.05,3.05 35.05,7.47 34.9,7.62 34.44,7.62 U$1.7 | R4.2 37.34,2.29 36.58,1.52 35.05,1.52 34.29,2.29 | 34.29,2.29 R3.1
N$7
  Top 0.152: 39.93,5.49 39.62,5.18 R6.2 39.93,5.49 | 39.93,5.49 40.69,6.25 40.69,10.97 40.23,11.43 33.53,11.43 32.77,10.67 32.77,10.21 U$1.12 | 39.93,5.49 37.95,7.47 37.95,7.77 R5.1
N$8
  Top 0.152: U$1.11 33.38,10.21 33.68,10.21 34.14,10.67 R7.1 37.95,10.67 39.47,9.14 39.47,7.92 R5.2
N$9
  Top 0.152: Q2.D1 32,13.41 33.22,13.41 33.68,12.95 35.05,12.95 35.51,13.41 Q1.D1 35.66,13.56 35.97,13.56 36.27,13.87 38.1,13.87 C23.2
N$10
  Top 0.152: R8.1 35.66,21.34 33.68,19.36 18.44,19.36 17.98,18.9 15.85,18.9 12.95,21.79 12.95,22.71 12.34,23.32 11.89,23.32 U$3.3
N$11
  Top 0.508: C12.1 L1.1 E1.ANT
N$14
  Bottom 0.152: JP1.1 J1.4
N$15
  Top 0.152: D2.A 32.46,32.46 34.29,32.46 R1.1
P00
  Top 0.152: U2.2 21.06,29.05 22.07,28.04 29.82,28.04 30.5,28.73 30.5,29.1 30.99,29.59 JP4.2
P01
  Top 0.152: U2.3 21.46,29.08 22.2,28.35 29.08,28.35 29.97,29.23 29.97,29.72 30.61,30.35 34.54,30.35 JP5.2
P02  (via drill 0.35)
  Top 0.152: v5.18,31.24 R21.2 | U2.4 21.86,29.57 v22.35,29.08 | v18.54,28.96 16.64,28.96 15.62,29.97 v15.24,29.97
  Bottom 0.152: v5.18,31.24 6.86,31.24 U$5.C5 7.21,30.99 11.56,30.99 12.57,29.97 v15.24,29.97 | v22.35,29.08 20.95,29.08 19.66,27.79 19.66,27.28 19.43,27.05 18.8,27.05 18.44,27.4 18.44,28.04 18.54,28.14 v18.54,28.96
P03  (via drill 0.35)
  Top 0.152: v5.18,33.22 3.5,33.22 R22.2 | v21.39,25.91 21.39,27.13 18.16,30.35 16.26,30.35 15.75,30.86 v15.75,31.85 | U2.5 22.32,30.61 22.32,30.16 22.99,29.49 23.37,29.49 23.5,29.36 v23.5,28.96
  Bottom 0.152: v15.75,31.85 14.53,33.07 7.01,33.07 U$5.C6 6.86,33.22 v5.18,33.22 | v21.39,25.91 22.81,25.91 v25.91,29.01 25.2,29.72 24.26,29.72 v23.5,28.96
P04  (via drill 0.35)
  Top 0.152: v5.18,35.2 3.5,35.2 R23.2 | v17.91,26.92 17.02,26.92 v15.11,28.83 | v11.56,29.84 10.54,30.86 v10.54,34.16 | U2.6 22.72,30.61 22.72,30.19 23.11,29.79 23.49,29.79 23.8,29.49 24.23,29.49 v24.77,28.96
  Bottom 0.152: v5.18,35.2 6.86,35.2 U$5.C7 8.73,35.21 9.78,34.16 v10.54,34.16 | v15.11,28.83 12.57,28.83 v11.56,29.84 | v24.77,28.96 22.32,26.52 21.14,26.52 20.78,26.16 20.78,24.97 20.7,24.89 19.94,24.89 v17.91,26.92
P05  (via drill 0.35)
  Top 0.152: v5.18,37.19 3.5,37.19 R24.2 | U2.7 23.06,30.28 23.24,30.1 23.5,30.1 | 23.5,30.1 | 23.5,30.1 23.62,30.1 23.92,29.8 26.49,29.8 v26.82,29.46
  Bottom 0.152: v26.82,29.46 26.82,30.33 20.12,37.03 7.16,37.03 U$5.C8 6.86,37.19 v5.18,37.19
P07  (via drill 0.35)
  Top 0.152: U2.9 23.92,30.61 23.92,30.23 24.05,30.1 25.27,30.1 25.4,30.23 v28.07,30.23 | D2.C v28.83,32.38
  Bottom 0.152: v28.07,30.23 28.07,31.62 v28.83,32.38
P18  (via drill 0.35)
  Top 0.152: U2.21 25.78,34.58 26.16,34.58 26.5,34.92 v28.45,34.92 | v29.97,36.45 30.86,37.34 36.6,37.34 36.78,37.52 36.78,40.82 36.47,41.12 34.24,41.12 33.27,40.16 J5.6
  Bottom 0.152: v28.45,34.92 v29.97,36.45
P22  (via drill 0.35)
  Top 0.152: v9.45,37.64 9.45,36.88 9.3,36.73 9.3,30.63 13.26,26.67 13.26,24.84 12.34,23.93 11.12,23.93 10.97,23.77 10.97,22.86 11.12,22.71 12.5,22.71 12.65,22.55 12.65,20.42 11.89,19.66 U$3.6 | v25.38,37.72 24.92,37.26 24.64,37.26 24.26,36.88 U2.27
  Bottom 0.152: v25.38,37.72 25.38,38.2 24.8,38.77 24.3,38.77 24,38.48 22.73,38.48 22.35,38.1 22.35,37.47 22.1,37.21 20.37,37.21 20.24,37.34 9.75,37.34 v9.45,37.64
P23  (via drill 0.35)
  Top 0.152: U2.28 23.86,37.45 24.19,37.45 28.88,42.14 35.89,42.14 37.08,40.94 37.08,36.45 v37.59,35.94 | v24.38,14.99 22.35,17.02 U$3.9
  Bottom 0.152: v24.38,14.99 25.1,15.7 35.61,15.7 37.59,17.68 v37.59,35.94
P24  (via drill 0.35)
  Top 0.152: v23.72,39.14 23.47,38.89 23.47,36.42 U2.29 | v27.89,18.75 18.29,18.75 17.83,18.29 U$3.10
  Bottom 0.152: v23.72,39.14 24.87,39.14 26.67,37.34 26.67,34.8 27.81,33.66 27.81,31.8 27.46,31.45 27.46,19.17 v27.89,18.75
P25
  Top 0.152: U2.37 19.96,35.81 15.14,35.81 14.17,34.85 14.17,21.03 15.54,19.66 17.37,19.66 U$3.11
P26  (via drill 0.35)
  Top 0.152: v15.24,24.66 14.48,25.43 14.48,34.44 15.39,35.36 19.96,35.36 U2.38
  Bottom 0.152: J1.3 14.33,2.59 15.54,1.37 17.22,1.37 17.98,2.13 17.98,7.32 18.67,8 18.67,14.99 20.83,17.14 20.83,21.59 17.75,24.66 v15.24,24.66
P27  (via drill 0.35)
  Top 0.152: v15.09,31.09 15.09,34.14 15.85,34.9 19.96,34.9 U2.39
  Bottom 0.152: J1.2 16.76,2.74 11.3,8.2 5.21,8.2 4.27,9.14 4.27,21.18 5.31,22.23 9.88,22.23 15.98,28.32 15.98,30.2 v15.09,31.09
P28  (via drill 0.35)
  Top 0.152: R13.2 3.5,15.09 v5.18,15.09 8.61,15.09 9.53,16 v9.53,19.56 | U2.40 17.13,34.53 v16.64,34.04
  Bottom 0.152: v5.18,15.09 6.86,15.09 U$5.C1 | v16.64,34.04 16.64,33.73 17.37,32.99 17.37,28.37 9.42,20.42 9.42,19.66 v9.53,19.56
P29  (via drill 0.35)
  Top 0.152: v5.18,17.22 3.5,17.22 R14.2 | U2.41 18.02,34.13 16.76,32.87 v16.26,32.87
  Bottom 0.152: v16.26,32.87 17.02,32.11 17.02,28.45 8.53,19.96 8.53,18.44 7.32,17.22 7.01,17.22 U$5.C2 6.86,17.22 v5.18,17.22
P30  (via drill 0.35)
  Top 0.152: v16.41,31.22 16.41,31.47 18.62,33.68 19.96,33.68 U2.42 | v5.18,19.2 3.5,19.2 R15.2
  Bottom 0.152: v16.41,31.22 16.41,28.3 7.47,19.36 7.01,19.36 U$5.C3 6.86,19.2 v5.18,19.2
P31  (via drill 0.35)
  Top 0.152: v5.18,7.32 3.5,7.32 R16.2 | U2.43 18.98,33.33 18.03,32.38 v18.03,31.88
  Bottom 0.152: U$5.C4 6.86,7.32 v5.18,7.32 5.18,7.8 3.96,9.02 3.96,22.96 5.21,24.2 8.48,24.2 9.27,25 9.27,29.59 8.64,30.22 5.34,30.22 4.58,30.99 4.58,33.48 5.3,34.2 8.22,34.2 9.05,33.38 15.12,33.38 16.39,34.64 16.89,34.64 17.68,33.86 17.68,32.23 v18.03,31.88
SWDCLK  (via drill 0.35)
  Top 0.152: J5.4 31.88,39.75 v30.1,41.53 | U2.25 25.95,36.39 26.33,36.77 26.33,38.52 27.43,39.62 v27.81,39.62
  Bottom 0.152: v30.1,41.53 28.19,39.62 v27.81,39.62
SWDIO
  Top 0.152: J5.2 29.91,40.58 27.75,40.58 25.98,38.81 25.98,37.16 25.78,36.96 24.77,36.96 24.66,36.85 U2.26
VB_PRI_ON  (via drill 0.35)
  Top 0.152: v31.55,12.8 31.24,13.11 31.24,13.41 Q2.G1 | v32.77,14.02 32.31,14.48 32,14.48 Q2.G2 | v34.29,9.91 34.29,9.14 U$1.10
  Bottom 0.152: v32.77,14.02 v31.55,12.8 31.55,12.65 v34.29,9.91
VB_SEC_ON  (via drill 0.35)
  Top 0.152: Q1.G1 34.75,13.56 v33.98,13.56 33.38,14.17 33.38,14.78 33.68,15.09 34.9,15.09 35.51,14.48 Q1.G2 | v35.2,10.06 35.2,8.99 34.9,8.69 34.44,8.69 U$1.9
  Bottom 0.152: v35.2,10.06 35.2,12.34 v33.98,13.56
VBAT_PRI
  Top 0.152: 28.96,13.72 28.19,12.95 C19.2 | 28.96,13.72 29.72,14.48 31.09,14.48 Q2.D2 | 28.96,13.72 31.7,10.97 31.7,10.21 U$1.14
VDD  (via drill 0.35)
  Top 0.152: R8.2 31.85,21.34 30.84,20.32 | v19.96,30.23 19.96,31.24 U2.48 | v19.18,36.42 20.57,36.42 U2.36 | U2.13 25.76,31.24 34.9,31.24 35.97,32.31 R1.2 35.97,32.46 v35.97,33.53 | v36.73,17.68 36.88,17.68 37.64,18.44 C2.1 | v32.61,17.98 29.72,17.98 U1.5 30.32,18.67 v30.73,18.67 | v32.51,20.32 30.84,20.32 | 30.84,20.32 30.79,20.27 C17.1 30.63,20.27 28.04,20.27 27.89,20.42 C15.1 27.74,20.57 24.99,20.57 C16.1 24.84,20.57 22.86,20.57 17.53,25.91 U$3.16 18.67,25.91 19.05,26.29 v19.05,27.79
  Bottom 0.152: v19.05,27.79 19.81,28.55 19.81,30.07 | 19.81,30.07 19.81,32.51 19.18,33.15 v19.18,36.42 | 19.81,30.07 v19.96,30.23 | 36.73,17.98 36.73,32.46 35.81,33.38 | 35.81,33.38 30.79,38.41 J5.1 | 36.73,17.98 v32.61,17.98 | 36.73,17.98 v36.73,17.68 | 35.81,33.38 v35.97,33.53 | v30.73,18.67 30.86,18.67 v32.51,20.32
VIN  (via drill 0.35)
  Top 0.152: C1.1 35.66,18.44 35.36,18.44 33.53,16.61 27.89,16.61 27.43,16.15 27.13,16.15 U1.3 26.98,16.15 26.82,16.31 v25.76,16.31 | v25.76,17.53 26.06,17.83 26.98,17.83 U1.1 | v9.53,6.99 9.53,9.53 v12.83,12.83 | v17.27,14.61 v20.95,14.61
  Bottom 0.152: v25.76,17.53 v25.76,16.31 24.33,16.31 JP2.1 23.75,18.16 23.62,18.29 21.72,18.29 21.72,14.86 21.46,14.61 v20.95,14.61 | JP1.2 11.05,6.99 v9.53,6.99 | v12.83,12.83 14.61,14.61 v17.27,14.61
VIN_SOLAR  (via drill 0.35)
  Top 0.152: C8.2 24.38,8.84 21.64,8.84 C7.2 21.64,8.69 21.64,7.01 v21.95,6.71 | v30.63,5.18 31.39,5.18 31.7,5.49 31.7,5.94 U$1.2 | J2.1 29.57,1.37 22.1,1.37 20.73,2.74 20.73,7.01 17.96,9.78 16.38,9.78 16.38,10.87 U$2.P$1
  Bottom 0.152: v30.63,5.18 30.63,2.9 J2.1 29.57,1.37 22.1,1.37 21.18,2.29 21.18,3.05 21.95,3.81 v21.95,6.71
VRDIV
  Top 0.152: 36.73,8.23 34.44,8.23 U$1.8 | 36.73,8.23 37.19,8.69 38.56,8.69 38.71,8.53 38.71,7.32 39.01,7.01 40.23,7.01 40.39,7.16 40.39,9.91 39.62,10.67 R7.2 | R3.2 36.42,2.29 37.19,3.05 38.56,3.05 38.71,2.9 38.71,1.68 38.86,1.52 40.23,1.52 40.39,1.68 40.39,2.9 38.71,4.57 38.71,5.64 36.73,7.62 36.73,8.23
VSTOR  (via drill 0.35)
  Top 0.152: v33.98,14.48 34.75,14.48 Q1.D2 | v24.69,13.87 24.69,13.41 24.23,12.95 C20.2 24.08,12.8 22.55,12.8 C21.2 | v28.65,7.47 28.8,7.62 30.18,7.62 U$1.19 | v29.11,5.79 30.33,4.57 31.24,4.57 32.16,5.49 32.16,5.94 U$1.3
  Bottom 0.152: v33.98,14.48 33.22,14.48 33.07,14.63 28.65,14.63 | 28.65,14.63 25.45,14.63 v24.69,13.87 23.72,13.87 22.73,14.86 JP2.2 | 28.65,14.63 v28.65,7.47 29.11,7.01 v29.11,5.79
XC1
  Top 0.152: U2.34 21.49,36.42 21.49,36.88 20.73,37.64 13.41,37.64 12.8,38.25 Y1.3 12.8,38.41 12.19,39.01 11.28,39.01 C9.2
XC2
  Top 0.152: U2.35 21.03,36.42 21.03,36.88 20.88,37.03 13.87,37.03 Y1.1 13.87,36.88 13.26,36.27 11.28,36.27 C10.1

### Text on the board
tPlace: Opto Sense / Ver 1.0 | Georgia / Tech